# Altium schematic sheet Motor_Driver_2.SchDoc
size A4; SheetNumber: 9; SheetTotal: 10
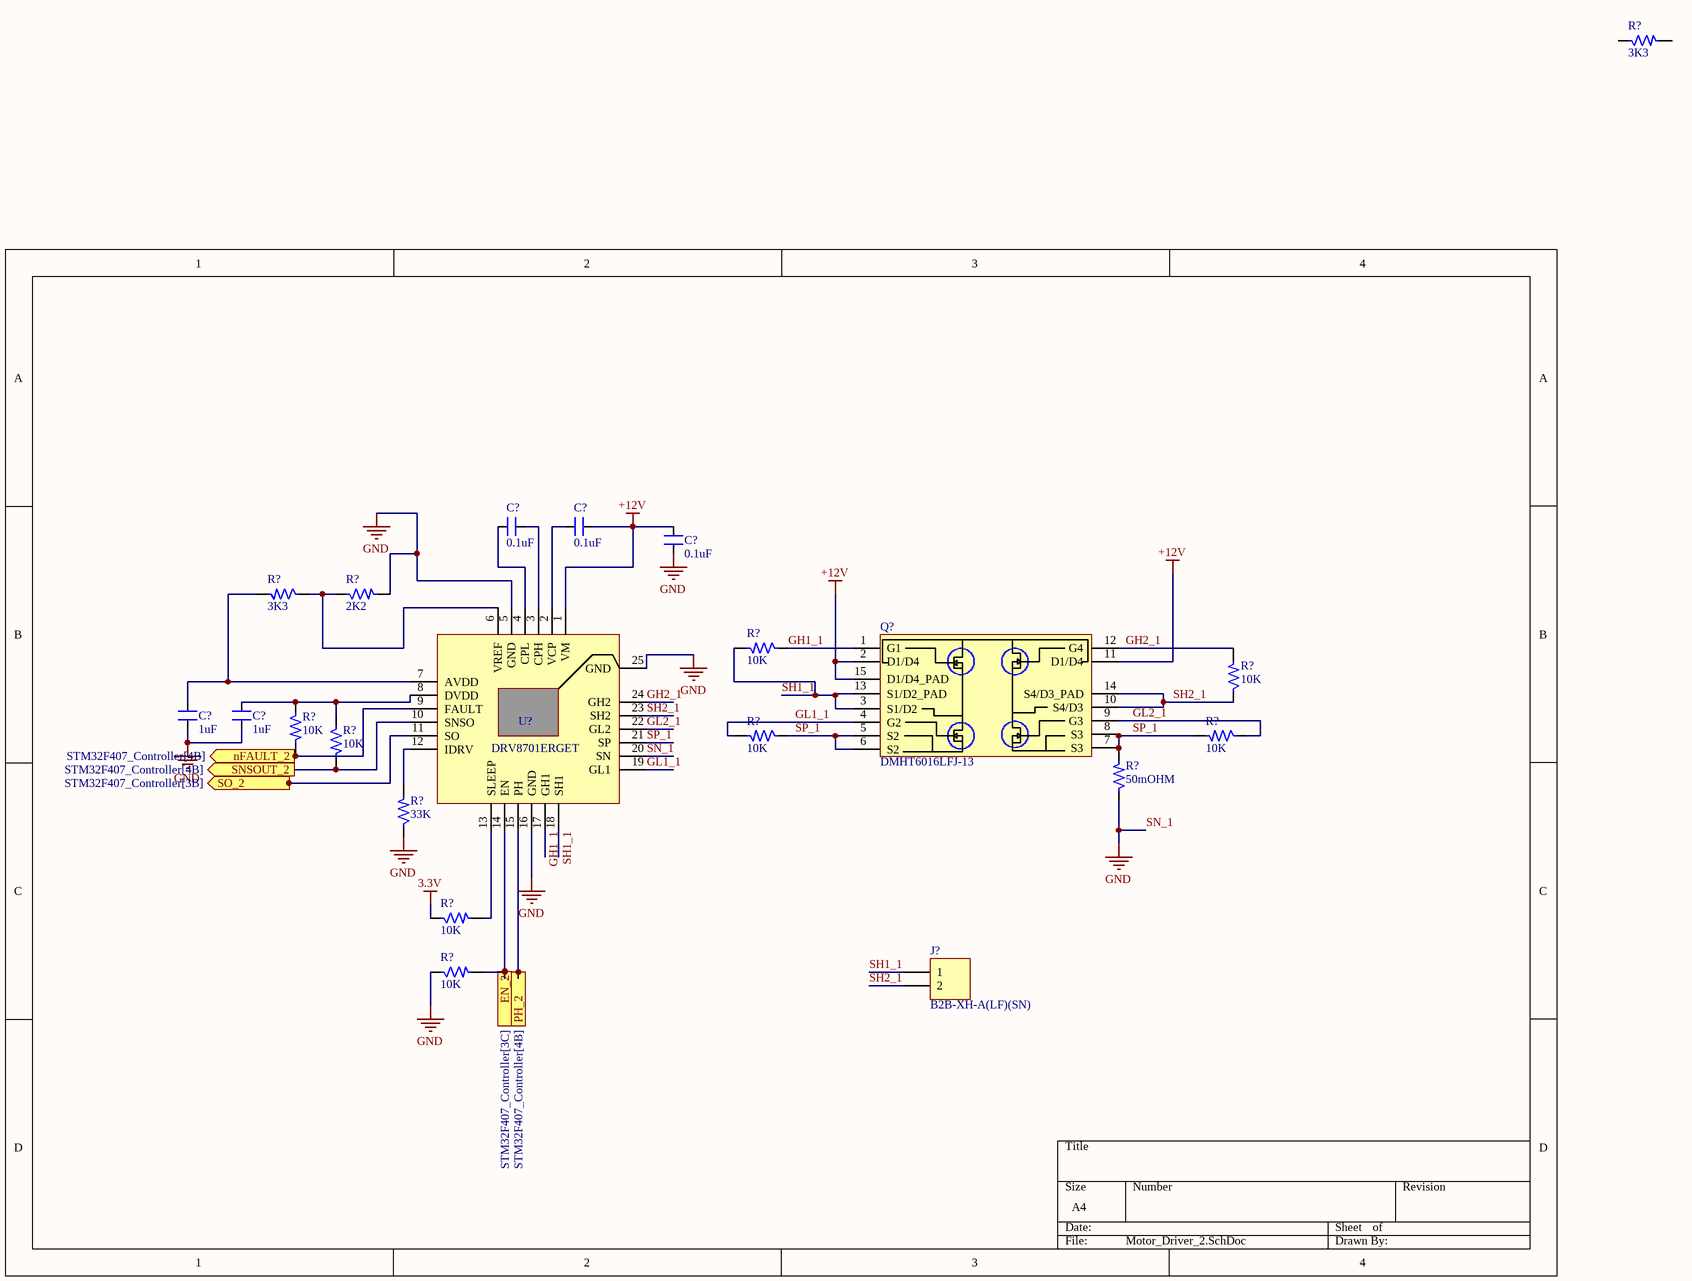
[diagram p0: Motor_Driver_2.SchDoc]

## Parts
(Parts that share a designator on the sheet are numbered #1, #2 ... from top to bottom, then left to right.)
C?#1  0.1uF  [CAP_0805]
C?#2  0.1uF  [CAP_0805]
C?#3  0.1uF  [CAP_0805]
C?#4  1uF  [CAP_0805]
C?#5  1uF  [CAP_0805]
J?  B2B-XH-A(LF)(SN)  [CON2_100_B2B-XH-A_TH_ST]
Q?  DMHT6016LFJ-13  [DFN5045-12_33_212_27X15_SMD_1]
R?#1  3K3  [RES_0603]
R?#2  3K3  [RES_0603]
R?#3  2K2  [RES_0603]
R?#4  10K  [RES_0805]
R?#5  10K  [RES_0805]
R?#6  10K  [RES_0805]
R?#7  10K  [RES_0805]
R?#8  10K  [RES_0805]
R?#9  10K  [RES_0805]
R?#10  50mOHM  [RES_2512]
R?#11  33K  [RES_0805]
R?#12  10K  [RES_0603]
R?#13  10K  [RES_0805]
U?  DRV8701ERGET  [VFQFN24_19.6_196_12X32_SMD_1]

## Ports
EN_2 (in, see STM32F407_Controller[3C]), nFAULT_2 (out, see STM32F407_Controller[4B]), PH_2 (in, see STM32F407_Controller[4B]), SNSOUT_2 (out, see STM32F407_Controller[4B]), SO_2 (out, see STM32F407_Controller[3B])

## Nets
3.3V: R?#12.1
+12V: C?#2.1 C?#3.2 Q?.2(D1/D4) Q?.11(D1/D4) Q?.15(D1/D4_PAD) U?.1(VM)
SN_1: C?#3.1 C?#4.1 C?#5.1 R?#3.2 R?#10.1 R?#11.1 R?#13.1 U?.5(GND) U?.16(GND) U?.20(SN) U?.25(GND)  [also labelled GND]
EN_2: R?#13.2 U?.14(EN) ; port EN_2
GH1_1: Q?.1(G1) R?#4.1 U?.17(GH1)
GH2_1: Q?.12(G4) R?#6.2 U?.24(GH2)
GL1_1: Q?.4(G2) R?#8.2 U?.19(GL1)
GL2_1: Q?.9(G3) R?#9.1 U?.22(GL2)
nFAULT_2: R?#5.2 U?.9(FAULT) ; port nFAULT_2
PH_2: U?.15(PH) ; port PH_2
SH1_1: J?.1 Q?.3(S1/D2) Q?.13(S1/D2_PAD) R?#4.2 U?.18(SH1)
SH2_1: J?.2 Q?.10(S4/D3) Q?.14(S4/D3_PAD) R?#6.1 U?.23(SH2)
SNSOUT_2: R?#7.2 U?.10(SNSO) ; port SNSOUT_2
SO_2: U?.11(SO) ; port SO_2
SP_1: Q?.5(S2) Q?.6(S2) Q?.7(S3) Q?.8(S3) R?#8.1 R?#9.2 R?#10.2 U?.21(SP)
NetC?#1_1: C?#1.1 U?.3(CPH)
NetC?#1_2: C?#1.2 U?.4(CPL)
NetC?#2_2: C?#2.2 U?.2(VCP)
NetC?#4_2: C?#4.2 R?#2.2 U?.7(AVDD)
NetC?#5_2: C?#5.2 R?#5.1 R?#7.1 U?.8(DVDD)
NetR?#2_1: R?#2.1 R?#3.1 U?.6(VREF)
NetR?#11_2: R?#11.2 U?.12(IDRV)
NetR?#12_2: R?#12.2 U?.13(SLEEP)

Not connected (* = marked no-connect by the designer): R?#1 1 2

## Library data of the parts
C?#1-C?#3 = CAP_0.1uF-50V-20%-0805: 0.1µF ±20% 50V Ceramic Capacitor X7R 0805 (2012 Metric); Manufacturer: Samsung Electro-Mechanics; Manufacturer Part Number: CL21B104MBCNNNC; Alternate Part Number-1: NA; Case/Package: 0805; Supplier-1: SIRICOM; Supplier Part Number-1: 0805B104K500CT
C?#4 C?#5 = CAP_1uF-50V-5%-0805: 1µF ±5% 50V Ceramic Capacitor X7R 0805 (2012 Metric); Manufacturer: Samsung; Manufacturer Part Number: CC0805JKX7R9BB105; Alternate Part Number-1: 0805F105M500NT; Case/Package: 0805; Supplier-1: SIRICOM; Supplier Part Number-1: CL21B105KBFNNNE
J? = CON-PLG_2X1-100-ST-TH: 2 Pins, 1 Row 2.54mm Pitch, Straight Connector, male; Manufacturer: JST; Mating Part Number: XHP-2; Crimp Part Number: ASXHSXH22K51; Alternate Part Number-1: NA; Manufacturer Part Number: B2B-XH-A(LF)(SN); Case/Package: TH-CON; Supplier-1: SP ROAD; Supplier Part Number-1: B2B-XH-A(LF)(SN)
Q? = MOSFET-N_60V-14.8A-V-DFN5045-12: Mosfet Array 4 N-Channel 14.8A (Ta) Surface Mount V-DFN5045-12; Manufacturer: ON Semiconductor; Alternate Part Number-1: DMHT3006LFJ-13; Manufacturer Part Number: DMHT6016LFJ-13; Case/Package: DFN5045-12; Supplier-1: LCSC; Supplier Part Number-1: C460986
R?#1 R?#2 = RES_3.3K-0.1W-1%-0603: 3.3 kOhms ±1% 0.1W, 1/10W Chip Resistor 0603 (1608 Metric) Automotive AEC-Q200 Thick Film; Manufacturer: Wilson; Manufacturer Part Number: WR06X3301FTL; Alternate Part Number-1: 0603WAF3301T5E; Case/Package: 0603; Supplier-1: SIRICOM; Supplier Part Number-1: WR06X3301FTL
R?#3 = RES_2K2-0.1W-5%-0603: 2.2 kOhms ±5% 0.1W, 1/10W Chip Resistor 0603 (1608 Metric) Automotive AEC-Q200 Thick Film; Manufacturer: Stackpole Electronics; Manufacturer Part Number: ERJ-3GEYJ222V; Alternate Part Number-1: WR06X2201FTL; Case/Package: 0603; Supplier-1: SIRICOM; Supplier Part Number-1: WR06X2201FTL
R?#4-R?#9 R?#13 = RES_10K-0.125W-1%-0805: 10 kOhms ±1% 0.125W, 1/8W Chip Resistor 0805 (2012 Metric) Automotive AEC-Q200 Thick Film; Manufacturer: CTS; Manufacturer Part Number: WR08X1002FTL; Case/Package: 0805; Supplier-1: SIRICOM; Supplier Part Number-1: WR08X1002FTL; Alternate Part Number-1: WR08X1002FTL
R?#10 = RES_50mOhm-2W-1%-2512: 50 mOhms ±1% 2W Chip Resistor 2512 (6432 Metric) Automotive AEC-Q200, Current Sense, Moisture Resistant Metal Element; Manufacturer: Yageo; Manufacturer Part Number: PA2512FKF7W0R05E; Alternate Part Number-1: PMR100HZPFU5L00; Case/Package: 2512; Supplier-1: SIRICOM; Supplier Part Number-1: LR2512-22R060F1
R?#11 = RES_33K-0.125W-1%-0805: Thick Film Resistors - SMD 33KOhms 1/8W 150V33 kOhms ±1% 0.125W, 1/8W Chip Resistor 0805 (2012 Metric) Thick Film; Manufacturer: Vishay BCcomponents; Manufacturer Part Number: CRG0805F33K; Alternate Part Number-1: NA; Case/Package: 0805; Supplier-1: SIRICOM; Supplier Part Number-1: WR08X3302FTL
R?#12 = RES_10K-0.1W-1%-0603: 10 kOhms ±1% 0.1W, 1/10W Chip Resistor 0603 (1608 Metric) Automotive AEC-Q200 Thick Film; Manufacturer: Walsin; Manufacturer Part Number: WR06X1002FTL; Alternate Part Number-1: 0603WAJ0103T5E; Case/Package: 0603; Supplier-1: SIRICOM; Supplier Part Number-1: WR06X1002FTL
U? = IC_DRV8701ERGET: Motor Driver Power MOSFET Parallel 24-VQFN (4x4); Manufacturer: Texas Instruments; Alternate Part Number-1: NA; Manufacturer Part Number: DRV8701ERGET; Case/Package: VFQFN24; Supplier-1: ARROW; Supplier Part Number-1: DRV8701ERGET